# Altium schematic sheet B293A Z Amp.SchDoc: Z Amp
size A4; DocumentNumber: 293; Revision: A
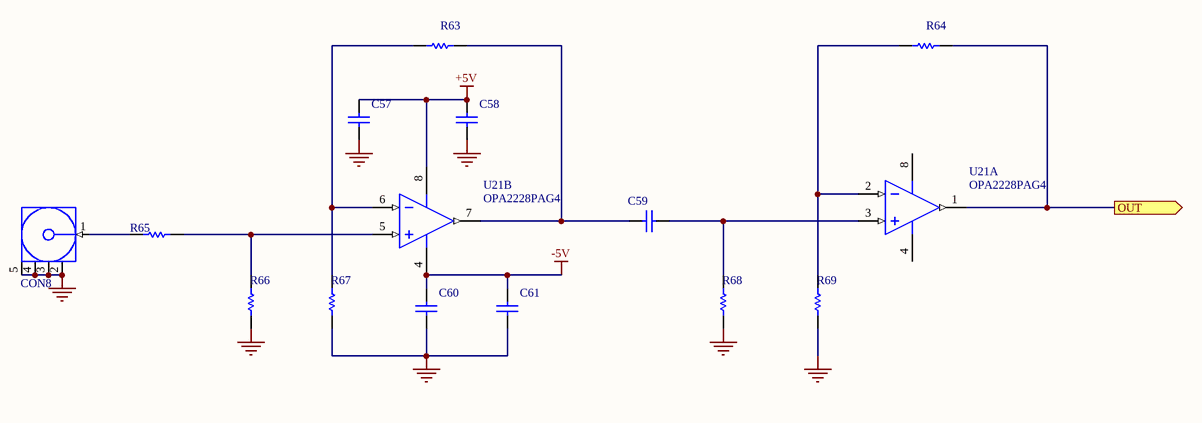
[diagram p0: B293A Z Amp.SchDoc]

## Parts
(Parts that share a designator on the sheet are numbered #1, #2 ... from top to bottom, then left to right.)
C57  CAP 10uF 25V 0805(2012)  [CAPC0805(2012)145_N]  (value not drawn)
C58  CAP 10nF 25V 0805(2012)  [CAPC0805(2012)75_L]  (value not drawn)
C59  CAP 1nF 50V 0805(2012)  [CAPC0805(2012)75_N]  (value not drawn)
C60  CAP 10nF 25V 0805(2012)  [CAPC0805(2012)75_L]  (value not drawn)
C61  CAP 10uF 25V 0805(2012)  [CAPC0805(2012)145_N]  (value not drawn)
CON8  SMA Vertical  [SMA Vertical]  (value not drawn)
R63  2K2 5% 0805(2012)  [RESC0805(2012)_L]  (value not drawn)
R64  2K2 5% 0805(2012)  [RESC0805(2012)_L]  (value not drawn)
R65  100R 5% 0805(2012)  [RESC0805(2012)_M]  (value not drawn)
R66  27K 5% 0805(2012)  [RESC0805(2012)_L]  (value not drawn)
R67  100R 5% 0805(2012)  [RESC0805(2012)_M]  (value not drawn)
R68  3K3 5% 0805(2012)  [RESC0805(2012)_M]  (value not drawn)
R69  100R 5% 0805(2012)  [RESC0805(2012)_M]  (value not drawn)
U21#1  OPA2228PAG4  [TI-P8]  (part A of 2)
U21#2  OPA2228PAG4  [TI-P8]  (part B of 2)

## Ports
OUT (out)

## Nets
+5V: C57.2 C58.2 U21#2.8(V+)
-5V: C60.2 C61.2 U21#2.4(V-)
GND: C57.1 C58.1 C60.1 C61.1 CON8.2(GND) CON8.3(GND) CON8.4(GND) CON8.5(GND) R66.1 R67.1 R68.1 R69.1
OUT: R64.2 U21#1.1(OUT_A) ; port OUT
NetC59_1: C59.1 R68.2 U21#1.3(IN_A+)
NetC59_2: C59.2 R63.2 U21#2.7(OUT_B)
NetCON8_1: CON8.1(Signal) R65.2
NetR63_1: R63.1 R67.2 U21#2.6(IN_B-)
NetR64_1: R64.1 R69.2 U21#1.2(IN_A-)
NetR65_1: R65.1 R66.2 U21#2.5(IN_B+)

Not connected (* = marked no-connect by the designer): U21#1 4(V-) 8(V+)

## Notes on the sheet
- Title
- Size:
- Date:
- A4
- Number:
- Time:
- Revision:
- Sheet
- of
- Engineer : Matthew Southgate
- Author    : Matthew Southgate
- File:

## Library data of the parts
C57 C61 = CMP-1036-04933-1: CAP 10uF 25V ±20% 0805 (2012 Metric) Thickness 1.45mm SMD; Case-EIA: 0805; Case-Metric: 2012; Technology: SMT; Tolerance: ±20%; Max Thickness: 1.45 mm; Value: 10uF; Rated Voltage: 25 V
C58 C60 = CMP-1036-03830-1: CAP 10nF 25V ±10% 0805 (2012 Metric) Thickness 0.75mm SMD; Case-Metric: 2012; Case-EIA: 0805; Value: 10nF; Max Thickness: 0.75 mm; Technology: SMT; Rated Voltage: 25 V; Tolerance: ±10%
C59 = CMP-1036-02975-1: CAP 1nF 50V ±5% 0805 (2012 Metric) Thickness 0.75mm SMD; Case-Metric: 2012; Case-EIA: 0805; Value: 1nF; Max Thickness: 0.75 mm; Tolerance: ±5%; Rated Voltage: 50 V; Technology: SMT
CON8 = SMA Vertical: Manufacturers Part No: 5-1814832-1; Order Code: 1248990; Supplier: Onecall
R63 R64 = CMP-1013-00082-1: 2K2 0.125W 5% 0805 (2012 Metric)  SMD; Value: 2200.00 Ohm; Case-Metric: 2012; Case-EIA: 0805; Technology: SMT; Tolerance: 5 %; Power: 0.125 W
R65 R67 R69 = CMP-1013-00050-1: 100R 0.125W 5% 0805 (2012 Metric)  SMD; Value: 100.00 Ohm; Case-Metric: 2012; Case-EIA: 0805; Technology: SMT; Tolerance: 5 %; Power: 0.125 W
R66 = CMP-1013-00108-1: 27K 0.125W 5% 0805 (2012 Metric)  SMD; Value: 27000.00 Ohm; Case-EIA: 0805; Case-Metric: 2012; Technology: SMT; Tolerance: 5 %; Power: 0.125 W
R68 = CMP-1013-00086-1: 3K3 0.125W 5% 0805 (2012 Metric)  SMD; Value: 3300.00 Ohm; Case-EIA: 0805; Case-Metric: 2012; Technology: SMT; Tolerance: 5 %; Power: 0.125 W
U21#1 U21#2 = CMP-0271-00383-1: High Precision, Low Noise Operational Amplifier, 5 to 36 V, -55 to 125 degC, 8-pin DIP (P8), Green (RoHS & no Sb/Br); Packing: TUBE; Sub Family: High Supply Voltage Amplifier (>=30V), Low Noise Amp (<=10nV/rtHz), Low Offset Voltage Amplifier (<=500uV), Precision Amplifier; CMRR(Min)(dB): 120; Vio (25C)(Max)(mV): 0.2; Total Supply Voltage(Max)(+5V is 5, +/-5V is 10): 36; Number of Channels: 2; Total Supply Voltage(Min)(+5V is 5, +/-5V is 10): 5; Rating: Catalog; GBW(Typ)(MHz): 33; Offset Drift(Typ)(uV/C): 0.3; IIB(Max)(pA): 10000; Iq per channel(Max)(mA): 3.8; Slew Rate(Typ)(V/us): 11; Code_JEDEC: MS-001; PackageDescription: 8-Pin Plastic In-Line, Body 9.59 x 6.35 mm, Pitch 2.54 mm; ComponentLink2URL: http://www.ti.com/lit/ds/symlink/opa2228.pdf; ComponentLink3URL: http://www.ti.com/litv/pdf/mpdi001b; PartNumber: OPA2228PAG4; PackageReference: P8; ComponentLink1URL: http://www.ti.com/; Eco-Plan: Green (RoHS & no Sb/Br); PackageVersion: 4040082/E, 04/2010; ComponentLink3Description: Package Specification; ComponentLink1Description: Manufacturer URL; Mounting Technology: Through Hole; DatasheetVersion: SBOS110A; ComponentLink2Description: Datasheet